# Altium schematic sheet main.SchDoc
size A4
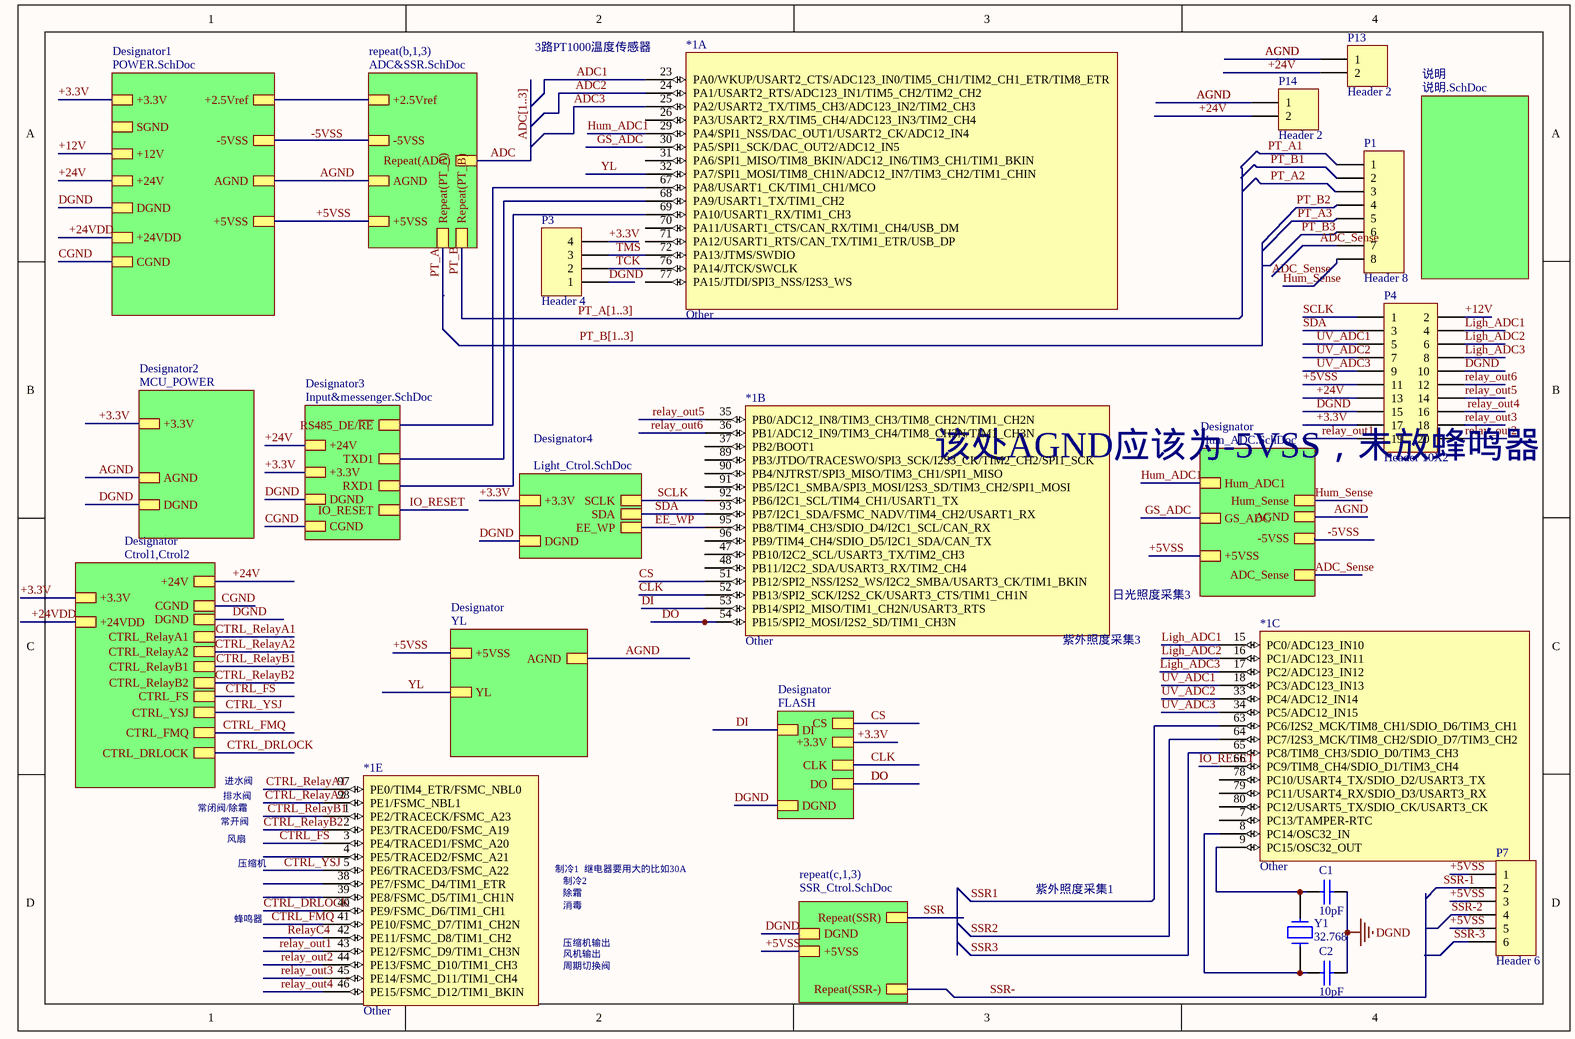
[diagram p0: main.SchDoc]

## Parts
*1  Other  [STM-LQFP100_N]  (parts A,B,C,E of 6)
C1  10pF  [0805C]
C2  10pF  [0805C]
P1  Header 8  [CONN-TH-KF7.62-8p]
P3  Header 4  [HDR1X4]
P4  Header 10X2  [HDR-TH_20P-P2.54_DC3-2.54-20PAS]
P7  Header 6  [CONN-TH_6P-P7.62_WJ25C-B-7.62-6P]
P13  Header 2  [2P]
P14  Header 2  [2PPPPP]
Y1  32.768  [XTAL6]

## Sub-sheets
Designator = Hum_ADC.SchDoc: Hum_ADC1, +5VSS, -5VSS, Hum_Sense, ADC_Sense, AGND, GS_ADC
Designator = FLASH: DGND, +3.3V, CLK, CS, DO, DI
Designator = Ctrol1,Ctrol2: +3.3V, +24V, DGND, CGND, CTRL_RelayA1, CTRL_RelayA2, CTRL_RelayB1, CTRL_RelayB2, CTRL_FS, CTRL_YSJ, CTRL_FMQ, CTRL_DRLOCK, +24VDD
Designator = YL: +5VSS, AGND, YL
Designator1 = POWER.SchDoc: +3.3V, +5VSS, +12V, +24V, AGND, DGND, -5VSS, SGND, +2.5Vref, CGND, +24VDD
Designator2 = MCU_POWER: +3.3V, AGND, DGND
Designator3 = Input&messenger.SchDoc: +24V, +3.3V, DGND, CGND, RS485_DE/~{RE}, TXD1, RXD1, IO_RESET
Designator4 = Light_Ctrol.SchDoc: SCLK, SDA, +3.3V, DGND, EE_WP
repeat(b,1,3) = ADC&SSR.SchDoc: -5VSS, AGND, +5VSS, +2.5Vref, Repeat(ADC), Repeat(PT_A), Repeat(PT_B)
repeat(c,1,3) = SSR_Ctrol.SchDoc: Repeat(SSR), DGND, +5VSS, Repeat(SSR-)
说明 = 说明.SchDoc: no entries

## Nets
DGND: C1.1 C2.1 P3.1 P4.10 P4.15 ; sheet Designator1/DGND, sheet Designator3/DGND, sheet Designator4/DGND, sheet Designator2/DGND, sheet repeat(c,1,3)/DGND, sheet Designator/DGND, sheet Designator/DGND
+3.3V: P3.4 P4.17 ; sheet Designator1/+3.3V, sheet Designator3/+3.3V, sheet Designator4/+3.3V, sheet Designator2/+3.3V, sheet Designator/+3.3V, sheet Designator/+3.3V
+5VSS: P4.11 P7.1 P7.3 P7.5 ; sheet Designator1/+5VSS, sheet repeat(b,1,3)/+5VSS, sheet repeat(c,1,3)/+5VSS, sheet Designator/+5VSS, sheet Designator/+5VSS
+12V: P4.2 ; sheet Designator1/+12V
+24V: P4.13 P13.2 P14.2 ; sheet Designator1/+24V, sheet Designator3/+24V, sheet Designator/+24V
+24VDD: sheet Designator1/+24VDD, sheet Designator/+24VDD
-5VSS: sheet Designator/-5VSS
ADC: sheet repeat(b,1,3)/Repeat(ADC)
ADC1: *1.23(PA0/WKUP/USART2_CTS/ADC123_IN0/TIM5_CH1/TIM2_CH1_ETR/TIM8_ETR)
ADC2: *1.24(PA1/USART2_RTS/ADC123_IN1/TIM5_CH2/TIM2_CH2)
ADC3: *1.25(PA2/USART2_TX/TIM5_CH3/ADC123_IN2/TIM2_CH3)
ADC_Sense: P1.7 ; sheet Designator/ADC_Sense
AGND: P13.1 P14.1 ; sheet Designator1/AGND, sheet repeat(b,1,3)/AGND, sheet Designator2/AGND, sheet Designator/AGND, sheet Designator/AGND
CGND: sheet Designator1/CGND, sheet Designator3/CGND, sheet Designator/CGND
CLK: *1.52(PB13/SPI2_SCK/I2S2_CK/USART3_CTS/TIM1_CH1N) ; sheet Designator/CLK
CS: *1.51(PB12/SPI2_NSS/I2S2_WS/I2C2_SMBA/USART3_CK/TIM1_BKIN) ; sheet Designator/CS
CTRL_DRLOCK: *1.40(PE9/FSMC_D6/TIM1_CH1) ; sheet Designator/CTRL_DRLOCK
CTRL_FMQ: *1.41(PE10/FSMC_D7/TIM1_CH2N) ; sheet Designator/CTRL_FMQ
CTRL_FS: *1.3(PE4/TRACED1/FSMC_A20) ; sheet Designator/CTRL_FS
CTRL_RelayA1: *1.97(PE0/TIM4_ETR/FSMC_NBL0) ; sheet Designator/CTRL_RelayA1
CTRL_RelayA2: *1.98(PE1/FSMC_NBL1) ; sheet Designator/CTRL_RelayA2
CTRL_RelayB1: *1.1(PE2/TRACECK/FSMC_A23) ; sheet Designator/CTRL_RelayB1
CTRL_RelayB2: *1.2(PE3/TRACED0/FSMC_A19) ; sheet Designator/CTRL_RelayB2
CTRL_YSJ: *1.5(PE6/TRACED3/FSMC_A22) ; sheet Designator/CTRL_YSJ
DI: *1.53(PB14/SPI2_MISO/TIM1_CH2N/USART3_RTS) ; sheet Designator/DI
DO: *1.54(PB15/SPI2_MOSI/I2S2_SD/TIM1_CH3N) ; sheet Designator/DO
EE_WP: *1.95(PB8/TIM4_CH3/SDIO_D4/I2C1_SCL/CAN_RX) ; sheet Designator4/EE_WP
GS_ADC: *1.30(PA5/SPI1_SCK/DAC_OUT2/ADC12_IN5) ; sheet Designator/GS_ADC
Hum_ADC1: *1.29(PA4/SPI1_NSS/DAC_OUT1/USART2_CK/ADC12_IN4) ; sheet Designator/Hum_ADC1
Hum_Sense: P1.8 ; sheet Designator/Hum_Sense
IO_RESET: *1.66(PC9/TIM8_CH4/SDIO_D1/TIM3_CH4) ; sheet Designator3/IO_RESET
Ligh_ADC1: *1.15(PC0/ADC123_IN10) P4.4
Ligh_ADC2: *1.16(PC1/ADC123_IN11) P4.6
Ligh_ADC3: *1.17(PC2/ADC123_IN12) P4.8
PT_A: sheet repeat(b,1,3)/Repeat(PT_A)
PT_A1: P1.1
PT_A2: P1.3
PT_A3: P1.5
PT_B: sheet repeat(b,1,3)/Repeat(PT_B)
PT_B1: P1.2
PT_B2: P1.4
PT_B3: P1.6
relay_out1: *1.43(PE12/FSMC_D9/TIM1_CH3N) P4.19
relay_out2: *1.44(PE13/FSMC_D10/TIM1_CH3) P4.20
relay_out3: *1.45(PE14/FSMC_D11/TIM1_CH4) P4.18
relay_out4: *1.46(PE15/FSMC_D12/TIM1_BKIN) P4.16
relay_out5: *1.35(PB0/ADC12_IN8/TIM3_CH3/TIM8_CH2N/TIM1_CH2N) P4.14
relay_out6: *1.36(PB1/ADC12_IN9/TIM3_CH4/TIM8_CH3N/TIM1_CH3N) P4.12
RelayC4: *1.42(PE11/FSMC_D8/TIM1_CH2)
SCLK: *1.92(PB6/I2C1_SCL/TIM4_CH1/USART1_TX) P4.1 ; sheet Designator4/SCLK
SDA: *1.93(PB7/I2C1_SDA/FSMC_NADV/TIM4_CH2/USART1_RX) P4.3 ; sheet Designator4/SDA
SSR: sheet repeat(c,1,3)/Repeat(SSR)
SSR1: *1.63(PC6/I2S2_MCK/TIM8_CH1/SDIO_D6/TIM3_CH1)
SSR2: *1.64(PC7/I2S3_MCK/TIM8_CH2/SDIO_D7/TIM3_CH2)
SSR3: *1.65(PC8/TIM8_CH3/SDIO_D0/TIM3_CH3)
SSR-: sheet repeat(c,1,3)/Repeat(SSR-)
SSR-1: P7.2
SSR-2: P7.4
SSR-3: P7.6
TCK: *1.76(PA14/JTCK/SWCLK) P3.2
TMS: *1.72(PA13/JTMS/SWDIO) P3.3
UV_ADC1: *1.18(PC3/ADC123_IN13) P4.5
UV_ADC2: *1.33(PC4/ADC12_IN14) P4.7
UV_ADC3: *1.34(PC5/ADC12_IN15) P4.9
YL: *1.32(PA7/SPI1_MOSI/TIM8_CH1N/ADC12_IN7/TIM3_CH2/TIM1_CHIN) ; sheet Designator/YL
Net*1_8: *1.8(PC14/OSC32_IN) C2.2 Y1.1
Net*1_9: *1.9(PC15/OSC32_OUT) C1.2 Y1.2
Net*1_67: *1.67(PA8/USART1_CK/TIM1_CH1/MCO) ; sheet Designator3/RS485_DE/~{RE}
Net*1_68: *1.68(PA9/USART1_TX/TIM1_CH2) ; sheet Designator3/TXD1
Net*1_69: *1.69(PA10/USART1_RX/TIM1_CH3) ; sheet Designator3/RXD1
(unnamed): sheet Designator1/-5VSS, sheet repeat(b,1,3)/-5VSS
(unnamed): sheet Designator1/+2.5Vref, sheet repeat(b,1,3)/+2.5Vref

Not connected (* = marked no-connect by the designer): *1 4(PE5/TRACED2/FSMC_A21) 7(PC13/TAMPER-RTC) 26(PA3/USART2_RX/TIM5_CH4/ADC123_IN3/TIM2_CH4) 31(PA6/SPI1_MISO/TIM8_BKIN/ADC12_IN6/TIM3_CH1/TIM1_BKIN) 37(PB2/BOOT1) 38(PE7/FSMC_D4/TIM1_ETR) 39(PE8/FSMC_D5/TIM1_CH1N) 47(PB10/I2C2_SCL/USART3_TX/TIM2_CH3) 48(PB11/I2C2_SDA/USART3_RX/TIM2_CH4) 70(PA11/USART1_CTS/CAN_RX/TIM1_CH4/USB_DM) 71(PA12/USART1_RTS/CAN_TX/TIM1_ETR/USB_DP) 77(PA15/JTDI/SPI3_NSS/I2S3_WS) 78(PC10/USART4_TX/SDIO_D2/USART3_TX) 79(PC11/USART4_RX/SDIO_D3/USART3_RX) 80(PC12/USART5_TX/SDIO_CK/USART3_CK) 89(PB3/JTDO/TRACESWO/SPI3_SCK/I2S3_CK/TIM2_CH2/SPI1_SCK) 90(PB4/NJTRST/SPI3_MISO/TIM3_CH1/SPI1_MISO) 91(PB5/I2C1_SMBA/SPI3_MOSI/I2S3_SD/TIM3_CH2/SPI1_MOSI) 96(PB9/TIM4_CH4/SDIO_D5/I2C1_SDA/CAN_TX)

## Buses and harness runs
bus ADC[1..3]
bus PT_A[1..3]
bus PT_B[1..3]

## Notes on the sheet
- 3路PT1000温度传感器
- 该处AGND应该为-5VSS，未放蜂鸣器
- 紫外照度采集3
- 日光照度采集3
- 进水阀
- 常闭阀/除霜
- 常开阀
- 排水阀
- 风扇
- 蜂鸣器
- 压缩机
- 制冷1  继电器要用大的比如30A
- 除霜
- 制冷2
- 消毒
- 紫外照度采集1
- 风机输出
- 压缩机输出
- 周期切换阀
- Labels drawn without touching a wire or pin: -5VSS, PT_B[1..3]

## Library data of the parts
*1 = stm32f103vct6
C1 C2 = CAP_3: 品牌： SAMSUNG(三星)  型号： CL21C100JCANNNC 容值：10pF 精度：±5% 额定电压：100V 材质(温度系数)：C0G C0G
P1 = Header 8: DG141V-2.54-8; LatestRevisionDate: 17-Jul-2002; LatestRevisionNote: Re-released for DXP Platform.; Publisher: Altium Limited
P3 = Header 4: 品牌： XFCN(兴飞) 型号： PZ254V-11-04P  排数：单排 总PIN位数：4P 间距：2.54mm 插针结构：1x4P 安装类型：直插 圆针/方针：方针 额定电流：3A 额定电压：250V 配合针长度：6mm 塑高：2.5mm 端接针长度：3mm 工作温度范围：-40℃~+105℃ 颜色：黑色; LatestRevisionDate: 17-Jul-2002; LatestRevisionNote: Re-released for DXP Platform.; Publisher: Altium Limited
P4 = Header 10X2: 品牌： ZHOURI(洲日)   型号： DC3-2.54-20PAS  ：连接器类型：简牛座 间距：2.54mm 结构：2x10P 排数：2 每排PIN数：10 行距：2.54mm 封装形式：直插 额定电流：1.5A 工作温度范围：-40℃~+105℃ 简易牛角 2.54-2x10 ROHS 直插; LatestRevisionDate: 17-Jul-2002; LatestRevisionNote: Re-released for DXP Platform.; Publisher: Altium Limited
P7 = Header 6: 品牌： KEFA(科发)  KF7.62-6p隔板类型：两面 间距：7.62mm 结构：1x2P 每排PIN数：2 排数：1 安装方式：直针 引脚位置：边脚 额定电流：24A 额定电压：450V 线规 - AWG：12~22 线规 - mm2：2.5 工作温度范围：-40℃~+105℃ 颜色：黑色 黑色; LatestRevisionDate: 17-Jul-2002; LatestRevisionNote: Re-released for DXP Platform.; Publisher: Altium Limited
P13 P14 = Header 2: DG141V-2.54-2P; LatestRevisionDate: 17-Jul-2002; LatestRevisionNote: Re-released for DXP Platform.; Publisher: Altium Limited
  P14: ComponentLink1Description: New link; ComponentLink1URL: *
Y1 = XTAL-2: 品牌： YXC(扬兴晶振)  型号： X308032768KGB2SC 频率：32.768kHz 频率公差：±10ppm 负载电容：12.5pF YT-38 温飘系数: -0.04x 10^(-6)/℃2